# EAGLE schematic main (EAGLE 6.5.0)
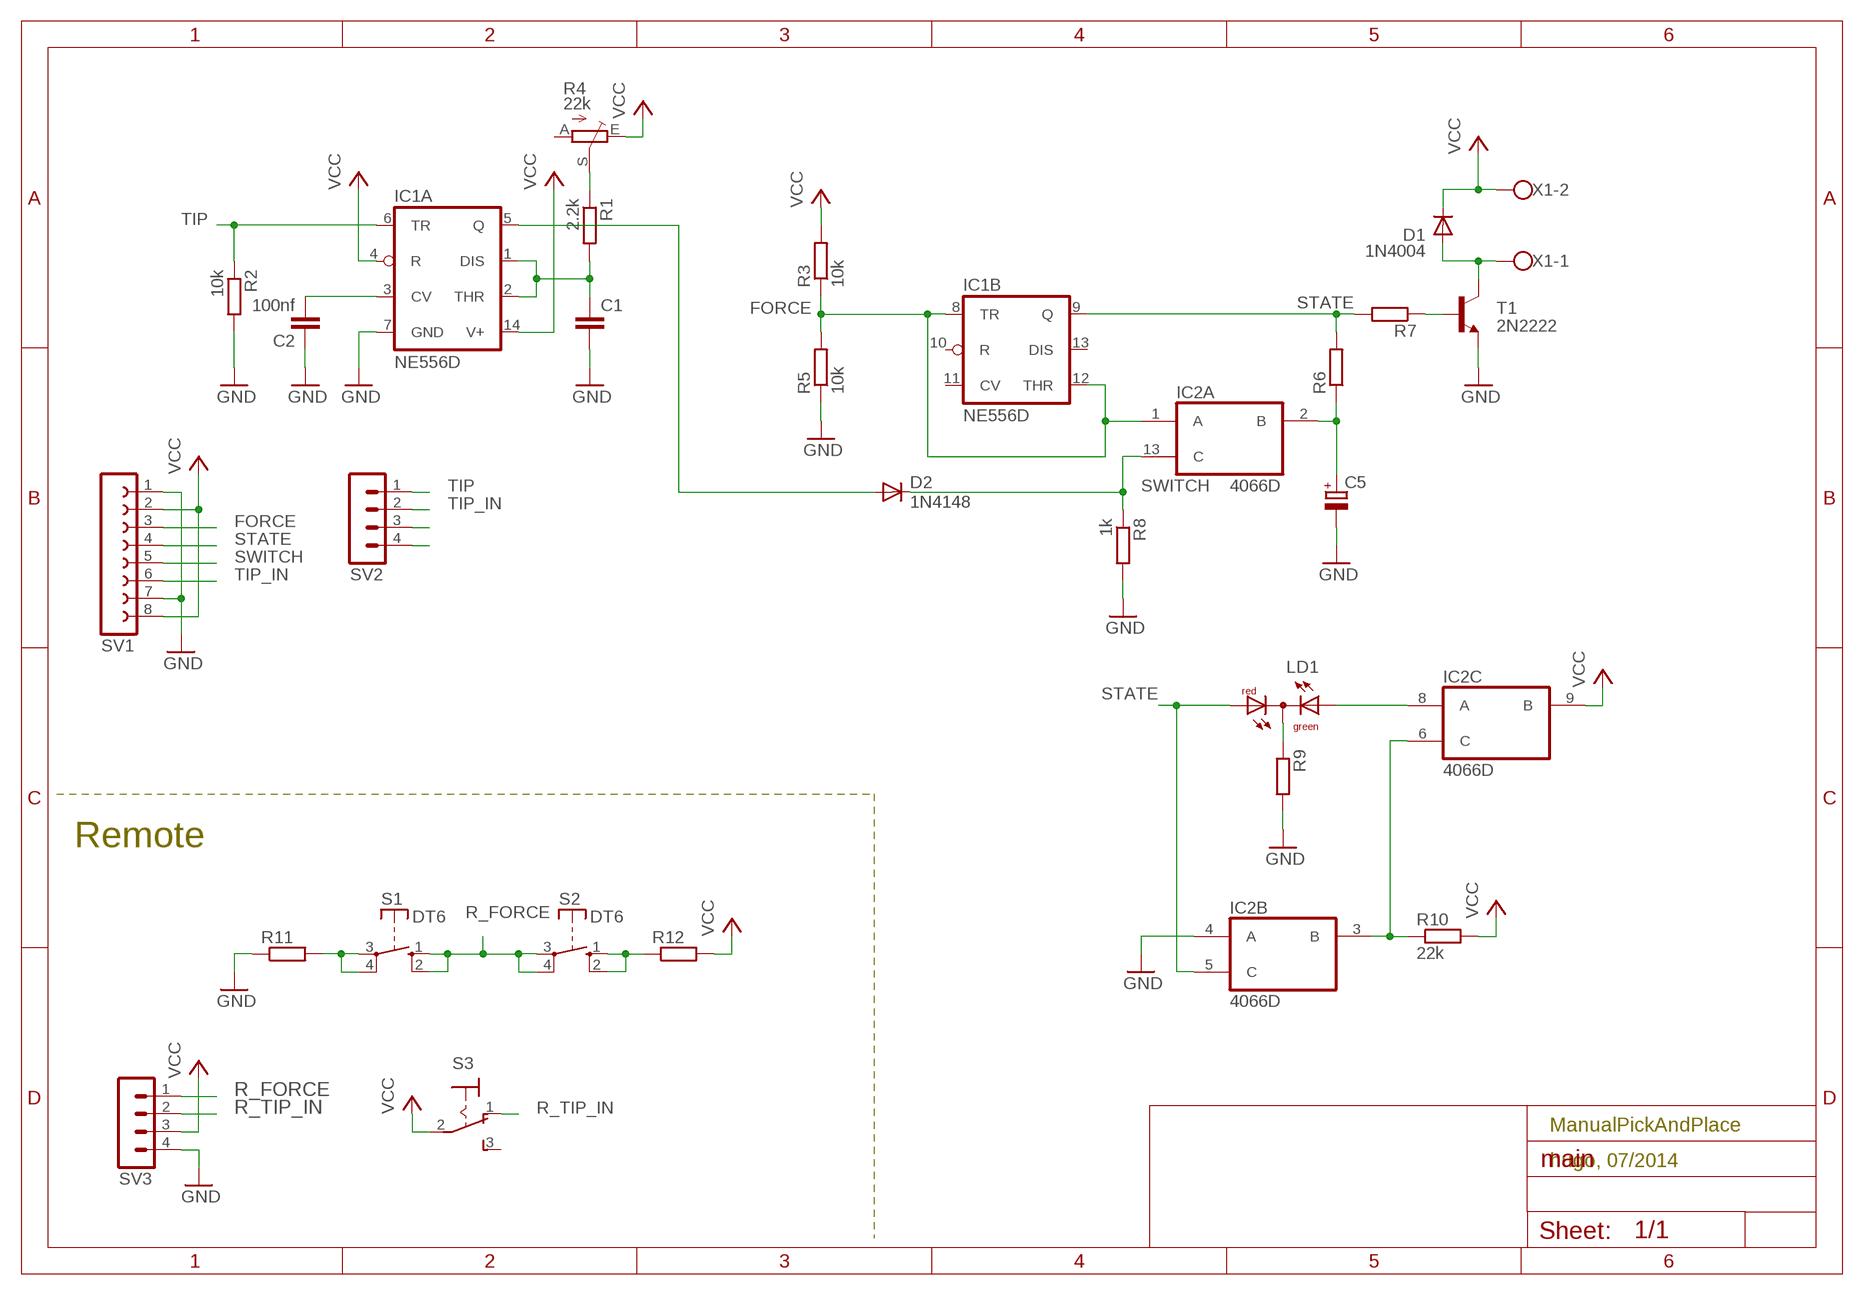
[diagram p0: schematic, sheet 1]

## Parts
C1  C-EUC0805  [C0805]
C2  100nf  C-EUC0805  [C0805]
C5  CPOL-EUE2,5-6E  [E2,5-6E]
D1  1N4004  [DO41-10]
D2  1N4148  1N4148DO35-7  [DO35-7]
IC1  NE556D  [SO14]
IC2  4066D  [SO14]
LD1  DUOLED-RG-C  [DUOLED-C-5MM]
R1  2.2k  R-EU_R0805  [R0805]
R2  10k  R-EU_R0805  [R0805]
R3  10k  R-EU_R0805  [R0805]
R4  22k  TRIM_EU-RJ6  [RJ6]
R5  10k  R-EU_R0805  [R0805]
R6  R-EU_R0805  [R0805]
R7  R-EU_R0805  [R0805]
R8  1k  R-EU_R0805  [R0805]
R9  R-EU_R0805  [R0805]
R10  22k  R-EU_R0805  [R0805]
R11  R-EU_R0805  [R0805]
R12  R-EU_R0805  [R0805]
S1  DT6  [DT6]
S2  DT6  [DT6]
S3  320-916  [320-916]
SV1  FE08-1  [FE08]
SV2  MA04-1  [MA04-1]
SV3  MA04-1  [MA04-1]
T1  2N2222  [TO18]
X1  W237-102  [W237-102]

## Nets
FORCE: IC1.8(B:TR) IC1.12(B:THR) IC2.1(A:A) R3.1 R5.2 SV1.3
GND: C1.2 C2.1 C5.- IC1.7(A:GND) IC2.4(B:A) R2.2 R5.1 R8.2 R9.2 R11.1 SV1.1 SV1.7 SV3.4 T1.1(E)
N$1: C2.2 IC1.3(A:CV)
N$3: R1.1 R4.S
N$4: C1.1 IC1.1(A:DIS) IC1.2(A:THR) R1.2
N$6: SV2.3
N$7: SV2.4
N$8: C5.+ IC2.2(A:B) R6.1
N$10: D1.A T1.3(C) X1.1
N$11: R11.2 S1.3(P) S1.4(P)
N$12: R7.1 T1.2(B)
N$13: D2.A IC1.5(A:Q)
N$14: LD1.C R9.1
N$15: IC2.8(C:A) LD1.AX(AG)
N$17: IC2.3(B:B) IC2.6(C:C) R10.1
N$19: R12.1 S2.1(S) S2.2(S)
R_FORCE: S1.1(S) S1.2(S) S2.3(P) S2.4(P) SV3.1
R_TIP_IN: S3.1(O) SV3.2
STATE: IC1.9(B:Q) IC2.5(B:C) LD1.AR R6.2 R7.2 SV1.4
SWITCH: D2.C IC2.13(A:C) R8.1 SV1.5
TIP: IC1.6(A:TR) R2.1 SV2.1
TIP_IN: SV1.6 SV2.2
VCC: D1.C IC1.4(A:R) IC1.14(A:V+) IC2.9(C:B) R3.2 R4.E R10.2 R12.2 S3.2(P) SV1.2 SV1.8 SV3.3 X1.2
Unconnected: IC1.10(B:R) IC1.11(B:CV) IC1.13(B:DIS) IC2.10(D:B) IC2.11(D:A) IC2.12(D:C) R4.A S3.3(S)

## Notes on the sheet
- Remote
- ManualPickAndPlace
- hugo, 07/2014

## Power pins joined to a net without a drawn wire
VDD: IC2.14(P:VDD)
VSS: IC2.7(P:VSS)

## Library data of the parts
C1 C2 = rcl:C-EU: CAPACITOR, European symbol
C5 = rcl:CPOL-EU: POLARIZED CAPACITOR, European symbol
D1 = diode:1N4004: DIODE general purpose rectifier, 1 A
D2 = diode:1N4148: DIODE high speed (Philips)
IC1 = linear:*556: Dual TIMER
IC2 = 40xx:4066: Quad bilateral ANALOG SWITCH
LD1 = led:DUOLED-RG-C: DUO LED 2 colors (red/green), 5 mm, round, common Cathode www.ligitek.com or other producers.
R1-R3 R5-R12 = rcl:R-EU_: RESISTOR, European symbol
R4 = pot:TRIM_EU-: POTENTIOMETER
S1 S2 = switch-misc:DT: ITT SWITCH
S3 = switch:320-916: TOGGLE SWITCH distributor RS Components
SV1 = con-lsta:FE08-1: FEMALE HEADER; OC_FARNELL: unknown; OC_NEWARK: unknown
SV2 SV3 = con-lstb:MA04-1: PIN HEADER; OC_FARNELL: unknown; OC_NEWARK: unknown
T1 = transistor:2N2222: NPN TRANSISTOR
X1 = con-wago-500:W237-102: WAGO SCREW CLAMP; MPN: 237-102; OC_FARNELL: unknown; OC_NEWARK: 70K9898